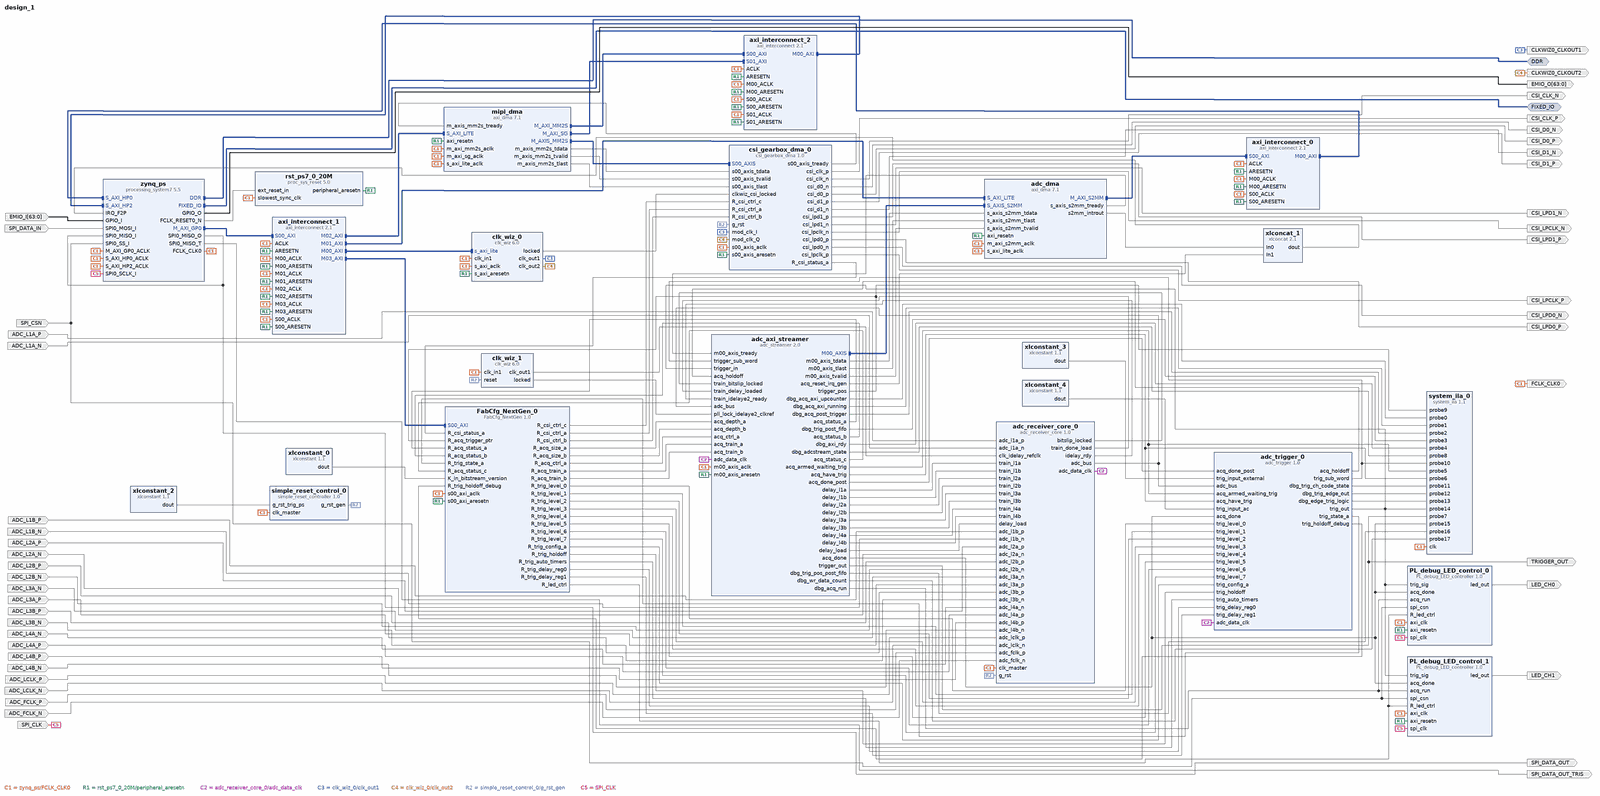
[diagram p0: block diagram of the top level, whole]
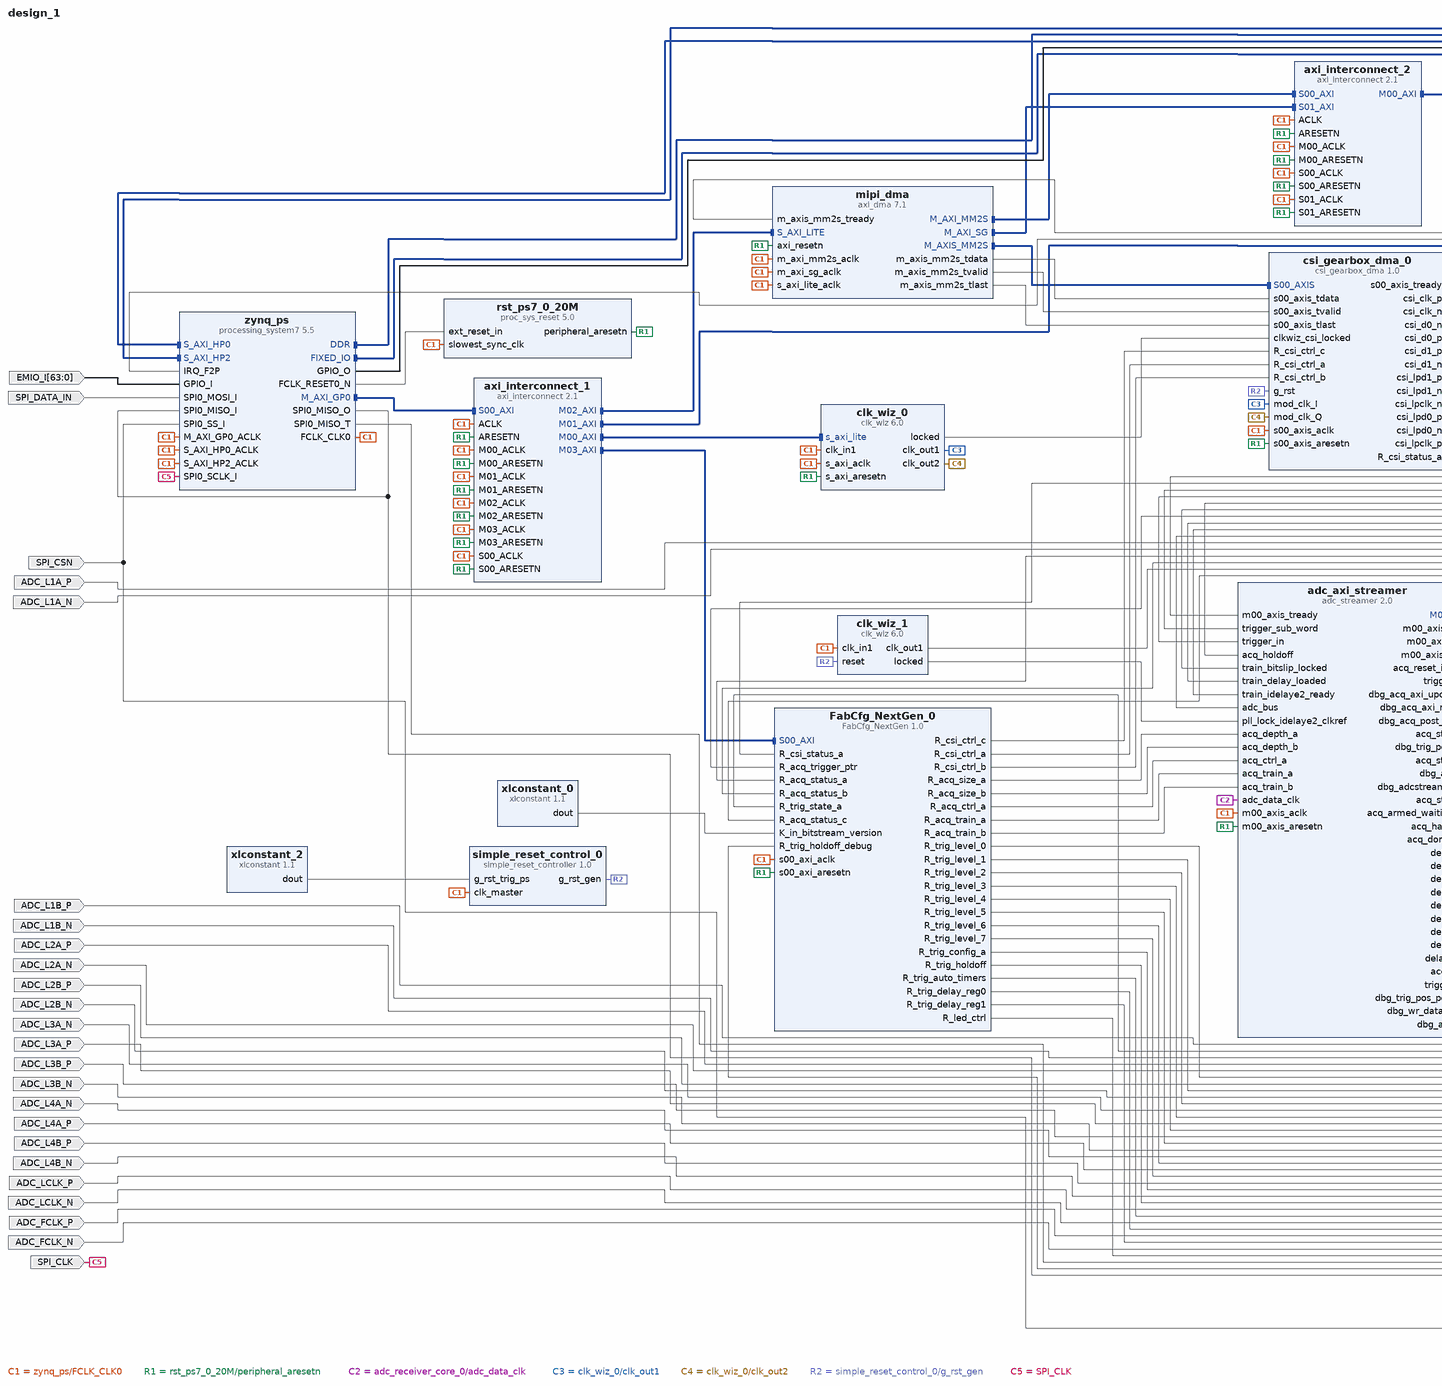
[diagram p1: block diagram of the top level, left part]
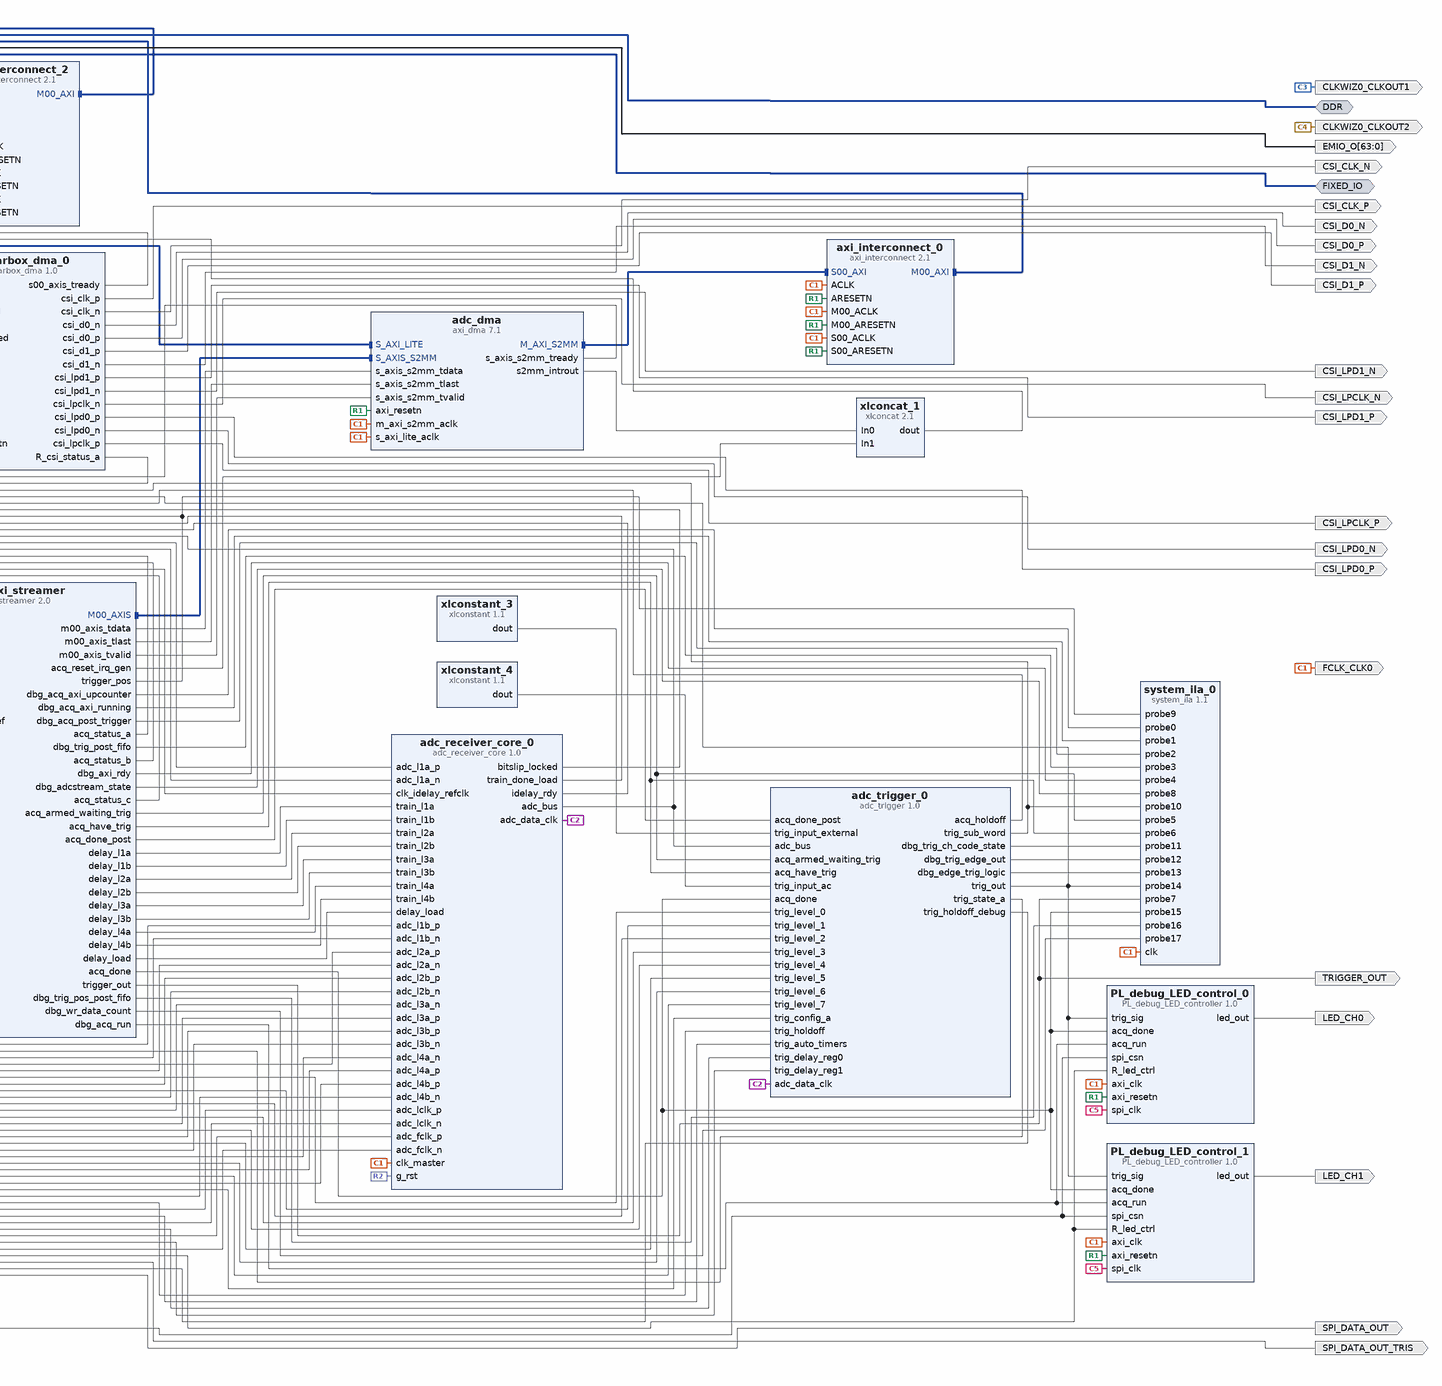
[diagram p2: block diagram of the top level, right part]
# Vivado block design design_1, xc7z014sclg400-1, Vivado 2019.2
create_bd_design design_1

create_bd_intf_port -mode Master -vlnv xilinx.com:interface:ddrx_rtl:1.0 DDR
create_bd_intf_port -mode Master -vlnv xilinx.com:display_processing_system7:fixedio_rtl:1.0 FIXED_IO
create_bd_port -dir O -type clk FCLK_CLK0
create_bd_port -dir I -from 63 -to 0 EMIO_I
create_bd_port -dir O -from 63 -to 0 EMIO_O
create_bd_port -dir O TRIGGER_OUT
create_bd_port -dir O -type clk CLKWIZ0_CLKOUT1
create_bd_port -dir O -type clk CLKWIZ0_CLKOUT2
create_bd_port -dir O CSI_CLK_P
create_bd_port -dir O CSI_CLK_N
create_bd_port -dir O CSI_D0_P
create_bd_port -dir O CSI_D0_N
create_bd_port -dir O CSI_D1_P
create_bd_port -dir O CSI_D1_N
create_bd_port -dir O CSI_LPD0_P
create_bd_port -dir O CSI_LPD0_N
create_bd_port -dir O CSI_LPD1_P
create_bd_port -dir O CSI_LPD1_N
create_bd_port -dir O CSI_LPCLK_P
create_bd_port -dir O CSI_LPCLK_N
create_bd_port -dir I ADC_L1A_P
create_bd_port -dir I ADC_L1A_N
create_bd_port -dir I ADC_L1B_P
create_bd_port -dir I ADC_L1B_N
create_bd_port -dir I ADC_L2A_P
create_bd_port -dir I ADC_L2B_P
create_bd_port -dir I ADC_L2A_N
create_bd_port -dir I ADC_L2B_N
create_bd_port -dir I ADC_L3A_P
create_bd_port -dir I ADC_L3A_N
create_bd_port -dir I ADC_L3B_P
create_bd_port -dir I ADC_L3B_N
create_bd_port -dir I ADC_L4A_P
create_bd_port -dir I ADC_L4B_P
create_bd_port -dir I ADC_L4A_N
create_bd_port -dir I ADC_L4B_N
create_bd_port -dir I ADC_LCLK_P
create_bd_port -dir I ADC_LCLK_N
create_bd_port -dir I ADC_FCLK_P
create_bd_port -dir I ADC_FCLK_N
create_bd_port -dir I SPI_CLK
create_bd_port -dir I SPI_DATA_IN
create_bd_port -dir O SPI_DATA_OUT
create_bd_port -dir O SPI_DATA_OUT_TRIS
create_bd_port -dir I SPI_CSN
create_bd_port -dir O LED_CH0
create_bd_port -dir O LED_CH1

create_bd_cell -type ip -vlnv xilinx.com:ip:proc_sys_reset:5.0 rst_ps7_0_20M
create_bd_cell -type ip -vlnv xilinx.com:ip:processing_system7:5.5 zynq_ps
set_property -dict [list \
  CONFIG.PCW_FPGA0_PERIPHERAL_FREQMHZ 177 \
  CONFIG.PCW_FPGA1_PERIPHERAL_FREQMHZ 150 \
  CONFIG.PCW_GPIO_EMIO_GPIO_ENABLE 1 \
  CONFIG.PCW_GPIO_EMIO_GPIO_IO 64 \
  CONFIG.PCW_GPIO_MIO_GPIO_ENABLE 1 \
  CONFIG.PCW_GPIO_MIO_GPIO_IO MIO \
  CONFIG.PCW_I2C_RESET_ENABLE 0 \
  CONFIG.PCW_IRQ_F2P_INTR 1 \
  CONFIG.PCW_SD0_GRP_CD_ENABLE 1 \
  CONFIG.PCW_SD0_GRP_CD_IO {MIO 46} \
  CONFIG.PCW_SD0_GRP_WP_ENABLE 1 \
  CONFIG.PCW_SD0_GRP_WP_IO {MIO 47} \
  CONFIG.PCW_SD0_PERIPHERAL_ENABLE 1 \
  CONFIG.PCW_SD0_SD0_IO {MIO 40 .. 45} \
  CONFIG.PCW_SDIO_PERIPHERAL_FREQMHZ 100 \
  CONFIG.PCW_SPI0_PERIPHERAL_ENABLE 1 \
  CONFIG.PCW_SPI0_SPI0_IO EMIO \
  CONFIG.PCW_TTC0_PERIPHERAL_ENABLE 1 \
  CONFIG.PCW_TTC0_TTC0_IO EMIO \
  CONFIG.PCW_TTC1_PERIPHERAL_ENABLE 1 \
  CONFIG.PCW_TTC1_TTC1_IO EMIO \
  CONFIG.PCW_UART1_BAUD_RATE 460800 \
  CONFIG.PCW_UART1_PERIPHERAL_ENABLE 1 \
  CONFIG.PCW_UART1_UART1_IO {MIO 48 .. 49} \
  CONFIG.PCW_UART_PERIPHERAL_FREQMHZ 100 \
  CONFIG.PCW_UIPARAM_DDR_BUS_WIDTH {16 Bit} \
  CONFIG.PCW_UIPARAM_DDR_PARTNO {MT41K128M16 JT-125} \
  CONFIG.PCW_USB_RESET_ENABLE 0 \
  CONFIG.PCW_USE_FABRIC_INTERRUPT 1 \
  CONFIG.PCW_USE_S_AXI_HP0 1 \
  CONFIG.PCW_USE_S_AXI_HP2 1 \
] [get_bd_cells zynq_ps]
# 243 more settings of zynq_ps are not shown: defaults, MIO pin electricals, DDR timing, and values the tool derives
create_bd_cell -type ip -vlnv xilinx.com:ip:axi_dma:7.1 adc_dma
set_property -dict [list \
  CONFIG.c_include_mm2s 0 \
  CONFIG.c_include_s2mm 1 \
  CONFIG.c_include_s2mm_dre 1 \
  CONFIG.c_include_sg 0 \
  CONFIG.c_m_axi_s2mm_data_width 64 \
  CONFIG.c_s2mm_burst_size 16 \
  CONFIG.c_sg_length_width 24 \
] [get_bd_cells adc_dma]
create_bd_cell -type ip -vlnv xilinx.com:ip:xlconcat:2.1 xlconcat_1
set_property -dict [list \
  CONFIG.IN0_WIDTH 1 \
  CONFIG.IN1_WIDTH 1 \
  CONFIG.IN2_WIDTH 1 \
  CONFIG.IN3_WIDTH 4 \
  CONFIG.NUM_PORTS 2 \
  CONFIG.dout_width 2 \
] [get_bd_cells xlconcat_1]
create_bd_cell -type ip -vlnv xilinx.com:ip:clk_wiz:6.0 clk_wiz_0
set_property -dict [list \
  CONFIG.CLKIN1_JITTER_PS 56.239999999999995 \
  CONFIG.CLKOUT1_JITTER 87.564 \
  CONFIG.CLKOUT1_PHASE_ERROR 97.786 \
  CONFIG.CLKOUT1_REQUESTED_OUT_FREQ 400.000 \
  CONFIG.CLKOUT2_JITTER 87.564 \
  CONFIG.CLKOUT2_PHASE_ERROR 97.786 \
  CONFIG.CLKOUT2_REQUESTED_OUT_FREQ 400.000 \
  CONFIG.CLKOUT2_REQUESTED_PHASE 90 \
  CONFIG.CLKOUT2_USED true \
  CONFIG.MMCM_CLKFBOUT_MULT_F 4.500 \
  CONFIG.MMCM_CLKIN1_PERIOD 5.625 \
  CONFIG.MMCM_CLKIN2_PERIOD 10.0 \
  CONFIG.MMCM_CLKOUT0_DIVIDE_F 2.000 \
  CONFIG.MMCM_CLKOUT1_DIVIDE 2 \
  CONFIG.MMCM_CLKOUT1_PHASE 90.000 \
  CONFIG.MMCM_DIVCLK_DIVIDE 1 \
  CONFIG.NUM_OUT_CLKS 2 \
  CONFIG.USE_DYN_RECONFIG true \
] [get_bd_cells clk_wiz_0]
create_bd_cell -type ip -vlnv xilinx.com:ip:axi_interconnect:2.1 axi_interconnect_1
set_property -dict [list \
  CONFIG.ENABLE_ADVANCED_OPTIONS 1 \
  CONFIG.ENABLE_PROTOCOL_CHECKERS 0 \
  CONFIG.NUM_MI 4 \
  CONFIG.NUM_SI 1 \
  CONFIG.S00_HAS_DATA_FIFO 2 \
  CONFIG.STRATEGY 2 \
  CONFIG.SYNCHRONIZATION_STAGES 2 \
] [get_bd_cells axi_interconnect_1]
create_bd_cell -type ip -vlnv xilinx.com:ip:axi_dma:7.1 mipi_dma
set_property -dict [list \
  CONFIG.c_include_mm2s 1 \
  CONFIG.c_include_mm2s_dre 0 \
  CONFIG.c_include_s2mm 0 \
  CONFIG.c_include_sg 1 \
  CONFIG.c_m_axi_mm2s_data_width 64 \
  CONFIG.c_m_axis_mm2s_tdata_width 64 \
  CONFIG.c_mm2s_burst_size 32 \
  CONFIG.c_sg_length_width 24 \
] [get_bd_cells mipi_dma]
create_bd_cell -type ip -vlnv xilinx.com:ip:axi_interconnect:2.1 axi_interconnect_2
set_property -dict {CONFIG.NUM_MI 1 CONFIG.NUM_SI 2} [get_bd_cells axi_interconnect_2]
create_bd_cell -type ip -vlnv xilinx.com:ip:xlconstant:1.1 xlconstant_0
set_property -dict {CONFIG.CONST_VAL 0xb37a0001 CONFIG.CONST_WIDTH 32} [get_bd_cells xlconstant_0]
create_bd_cell -type ip -vlnv xilinx.com:user:simple_reset_controller:1.0 simple_reset_control_0
create_bd_cell -type ip -vlnv xilinx.com:ip:xlconstant:1.1 xlconstant_2
set_property -dict {CONFIG.CONST_VAL 0 CONFIG.CONST_WIDTH 1} [get_bd_cells xlconstant_2]
create_bd_cell -type ip -vlnv xilinx.com:ip:clk_wiz:6.0 clk_wiz_1
set_property -dict [list \
  CONFIG.CLKIN1_JITTER_PS 56.239999999999995 \
  CONFIG.CLKOUT1_JITTER 100.156 \
  CONFIG.CLKOUT1_PHASE_ERROR 97.786 \
  CONFIG.CLKOUT1_REQUESTED_OUT_FREQ 200.000 \
  CONFIG.MMCM_CLKFBOUT_MULT_F 4.500 \
  CONFIG.MMCM_CLKIN1_PERIOD 5.625 \
  CONFIG.MMCM_CLKIN2_PERIOD 10.0 \
  CONFIG.MMCM_CLKOUT0_DIVIDE_F 4.000 \
] [get_bd_cells clk_wiz_1]
create_bd_cell -type ip -vlnv xilinx.com:ip:axi_interconnect:2.1 axi_interconnect_0
set_property -dict {CONFIG.NUM_MI 1 CONFIG.NUM_SI 1} [get_bd_cells axi_interconnect_0]
create_bd_cell -type ip -vlnv xilinx.com:ip:xlconstant:1.1 xlconstant_3
set_property -dict {CONFIG.CONST_VAL 0 CONFIG.CONST_WIDTH 1} [get_bd_cells xlconstant_3]
create_bd_cell -type ip -vlnv xilinx.com:ip:xlconstant:1.1 xlconstant_4
set_property -dict {CONFIG.CONST_VAL 0 CONFIG.CONST_WIDTH 1} [get_bd_cells xlconstant_4]
create_bd_cell -type ip -vlnv xilinx.com:user:adc_receiver_core:1.0 adc_receiver_core_0
create_bd_cell -type ip -vlnv xilinx.com:user:FabCfg_NextGen:1.0 FabCfg_NextGen_0
create_bd_cell -type ip -vlnv xilinx.com:user:PL_debug_LED_controller:1.0 PL_debug_LED_control_0
create_bd_cell -type ip -vlnv xilinx.com:user:PL_debug_LED_controller:1.0 PL_debug_LED_control_1
set_property -dict {CONFIG.LED_BYTE_CHANNEL 1} [get_bd_cells PL_debug_LED_control_1]
create_bd_cell -type ip -vlnv xilinx.com:user:csi_gearbox_dma:1.0 csi_gearbox_dma_0
set_property -dict {CONFIG.C_PN_SWAP_CLK true CONFIG.C_PN_SWAP_D0 true CONFIG.C_PN_SWAP_D1 true} [get_bd_cells csi_gearbox_dma_0]
create_bd_cell -type ip -vlnv xilinx.com:user:adc_trigger:1.0 adc_trigger_0
set_property -dict [list \
  CONFIG.TRIG_STATE_TRIGD_AUTO_INITIAL 5 \
  CONFIG.TRIG_STATE_TRIGD_AUTO_REPEAT 6 \
  CONFIG.TRIG_STATE_TRIGD_FORCE_AUTO 7 \
] [get_bd_cells adc_trigger_0]
create_bd_cell -type ip -vlnv xilinx.com:ip:system_ila:1.1 system_ila_0
set_property -dict {CONFIG.C_DATA_DEPTH 16384 CONFIG.C_MON_TYPE NATIVE CONFIG.C_NUM_OF_PROBES 18} [get_bd_cells system_ila_0]
create_bd_cell -type ip -vlnv xilinx.com:user:adc_streamer:2.0 adc_axi_streamer

# ---- connections ----

connect_bd_intf_net [get_bd_intf_pins axi_interconnect_1/M01_AXI] [get_bd_intf_pins adc_dma/S_AXI_LITE]
connect_bd_intf_net [get_bd_intf_pins mipi_dma/S_AXI_LITE] [get_bd_intf_pins axi_interconnect_1/M02_AXI]
connect_bd_intf_net [get_bd_intf_pins axi_interconnect_0/S00_AXI] [get_bd_intf_pins adc_dma/M_AXI_S2MM]
connect_bd_intf_net [get_bd_intf_pins axi_interconnect_2/S00_AXI] [get_bd_intf_pins mipi_dma/M_AXI_MM2S]
connect_bd_intf_net -intf_net processing_system7_0_DDR [get_bd_intf_ports DDR] [get_bd_intf_pins zynq_ps/DDR]
connect_bd_intf_net -intf_net axi_dma1_M_AXIS_MM2S [get_bd_intf_pins csi_gearbox_dma_0/S00_AXIS] [get_bd_intf_pins mipi_dma/M_AXIS_MM2S]
connect_bd_intf_net [get_bd_intf_pins axi_interconnect_1/M03_AXI] [get_bd_intf_pins FabCfg_NextGen_0/S00_AXI]
connect_bd_intf_net [get_bd_intf_pins axi_interconnect_1/M00_AXI] [get_bd_intf_pins clk_wiz_0/s_axi_lite]
connect_bd_intf_net [get_bd_intf_pins adc_axi_streamer/M00_AXIS] [get_bd_intf_pins adc_dma/S_AXIS_S2MM]
connect_bd_intf_net [get_bd_intf_pins axi_interconnect_0/M00_AXI] [get_bd_intf_pins zynq_ps/S_AXI_HP0]
connect_bd_intf_net [get_bd_intf_pins axi_interconnect_2/M00_AXI] [get_bd_intf_pins zynq_ps/S_AXI_HP2]
connect_bd_intf_net [get_bd_intf_pins zynq_ps/M_AXI_GP0] [get_bd_intf_pins axi_interconnect_1/S00_AXI]
connect_bd_intf_net [get_bd_intf_pins mipi_dma/M_AXI_SG] [get_bd_intf_pins axi_interconnect_2/S01_AXI]
connect_bd_intf_net -intf_net processing_system7_0_FIXED_IO [get_bd_intf_ports FIXED_IO] [get_bd_intf_pins zynq_ps/FIXED_IO]
connect_bd_net -net processing_system7_0_FCLK_CLK0 [get_bd_pins zynq_ps/FCLK_CLK0] \
  [get_bd_ports FCLK_CLK0] [get_bd_pins rst_ps7_0_20M/slowest_sync_clk] [get_bd_pins zynq_ps/S_AXI_HP0_ACLK] \
  [get_bd_pins adc_dma/s_axi_lite_aclk] [get_bd_pins adc_dma/m_axi_s2mm_aclk] [get_bd_pins zynq_ps/M_AXI_GP0_ACLK] \
  [get_bd_pins clk_wiz_0/s_axi_aclk] [get_bd_pins clk_wiz_0/clk_in1] [get_bd_pins axi_interconnect_1/M01_ACLK] \
  [get_bd_pins axi_interconnect_1/M00_ACLK] [get_bd_pins axi_interconnect_1/S00_ACLK] [get_bd_pins mipi_dma/m_axi_mm2s_aclk] \
  [get_bd_pins axi_interconnect_2/S00_ACLK] [get_bd_pins mipi_dma/s_axi_lite_aclk] [get_bd_pins axi_interconnect_2/M00_ACLK] \
  [get_bd_pins simple_reset_control_0/clk_master] [get_bd_pins clk_wiz_1/clk_in1] [get_bd_pins axi_interconnect_1/ACLK] \
  [get_bd_pins axi_interconnect_2/ACLK] [get_bd_pins axi_interconnect_0/ACLK] [get_bd_pins axi_interconnect_0/M00_ACLK] \
  [get_bd_pins axi_interconnect_0/S00_ACLK] [get_bd_pins axi_interconnect_1/M02_ACLK] \
  [get_bd_pins adc_receiver_core_0/clk_master] [get_bd_pins axi_interconnect_1/M03_ACLK] [get_bd_pins zynq_ps/S_AXI_HP2_ACLK] \
  [get_bd_pins mipi_dma/m_axi_sg_aclk] [get_bd_pins FabCfg_NextGen_0/s00_axi_aclk] \
  [get_bd_pins PL_debug_LED_control_0/axi_clk] [get_bd_pins PL_debug_LED_control_1/axi_clk] \
  [get_bd_pins axi_interconnect_2/S01_ACLK] [get_bd_pins csi_gearbox_dma_0/s00_axis_aclk] [get_bd_pins system_ila_0/clk] \
  [get_bd_pins adc_axi_streamer/m00_axis_aclk]
connect_bd_net [get_bd_pins rst_ps7_0_20M/peripheral_aresetn] \
  [get_bd_pins adc_dma/axi_resetn] [get_bd_pins clk_wiz_0/s_axi_aresetn] [get_bd_pins axi_interconnect_1/M00_ARESETN] \
  [get_bd_pins axi_interconnect_1/M01_ARESETN] [get_bd_pins axi_interconnect_1/S00_ARESETN] \
  [get_bd_pins axi_interconnect_1/ARESETN] [get_bd_pins axi_interconnect_2/S00_ARESETN] [get_bd_pins mipi_dma/axi_resetn] \
  [get_bd_pins axi_interconnect_2/ARESETN] [get_bd_pins axi_interconnect_2/M00_ARESETN] \
  [get_bd_pins axi_interconnect_0/ARESETN] [get_bd_pins axi_interconnect_0/M00_ARESETN] \
  [get_bd_pins axi_interconnect_0/S00_ARESETN] [get_bd_pins axi_interconnect_1/M02_ARESETN] \
  [get_bd_pins axi_interconnect_1/M03_ARESETN] [get_bd_pins FabCfg_NextGen_0/s00_axi_aresetn] \
  [get_bd_pins PL_debug_LED_control_0/axi_resetn] [get_bd_pins PL_debug_LED_control_1/axi_resetn] \
  [get_bd_pins axi_interconnect_2/S01_ARESETN] [get_bd_pins csi_gearbox_dma_0/s00_axis_aresetn] \
  [get_bd_pins adc_axi_streamer/m00_axis_aresetn]
connect_bd_net -net processing_system7_0_FCLK_RESET0_N [get_bd_pins zynq_ps/FCLK_RESET0_N] [get_bd_pins rst_ps7_0_20M/ext_reset_in]
connect_bd_net [get_bd_ports EMIO_I] [get_bd_pins zynq_ps/GPIO_I]
connect_bd_net -net processing_system7_0_GPIO_O [get_bd_pins zynq_ps/GPIO_O] [get_bd_ports EMIO_O]
connect_bd_net [get_bd_pins xlconcat_1/dout] [get_bd_pins zynq_ps/IRQ_F2P]
connect_bd_net -net axi_dma_s2mm_introut [get_bd_pins adc_dma/s2mm_introut] [get_bd_pins xlconcat_1/In0]
connect_bd_net -net ADC_DATA_CLK_2 [get_bd_pins adc_receiver_core_0/adc_data_clk] \
  [get_bd_pins adc_trigger_0/adc_data_clk] [get_bd_pins adc_axi_streamer/adc_data_clk]
connect_bd_net -net ACQ_TRIGGER_IN_1 [get_bd_pins adc_trigger_0/trig_out] \
  [get_bd_pins PL_debug_LED_control_0/trig_sig] [get_bd_pins PL_debug_LED_control_1/trig_sig] \
  [get_bd_pins system_ila_0/probe14] [get_bd_pins adc_axi_streamer/trigger_in]
connect_bd_net -net ACQ_TRIG_WORD_1 [get_bd_pins adc_trigger_0/trig_sub_word] \
  [get_bd_pins system_ila_0/probe10] [get_bd_pins adc_axi_streamer/trigger_sub_word]
connect_bd_net [get_bd_pins adc_axi_streamer/trigger_out] [get_bd_ports TRIGGER_OUT] [get_bd_pins system_ila_0/probe7]
connect_bd_net -net axi_dma_s_axis_s2mm_tready [get_bd_pins adc_dma/s_axis_s2mm_tready] [get_bd_pins adc_axi_streamer/m00_axis_tready]
connect_bd_net [get_bd_pins adc_axi_streamer/m00_axis_tdata] [get_bd_pins adc_dma/s_axis_s2mm_tdata]
connect_bd_net [get_bd_pins adc_axi_streamer/m00_axis_tlast] [get_bd_pins adc_dma/s_axis_s2mm_tlast]
connect_bd_net [get_bd_pins adc_axi_streamer/m00_axis_tvalid] [get_bd_pins adc_dma/s_axis_s2mm_tvalid]
connect_bd_net [get_bd_pins clk_wiz_0/clk_out1] [get_bd_ports CLKWIZ0_CLKOUT1] [get_bd_pins csi_gearbox_dma_0/mod_clk_I]
connect_bd_net [get_bd_pins clk_wiz_0/clk_out2] [get_bd_ports CLKWIZ0_CLKOUT2] [get_bd_pins csi_gearbox_dma_0/mod_clk_Q]
connect_bd_net [get_bd_pins mipi_dma/m_axis_mm2s_tdata] [get_bd_pins csi_gearbox_dma_0/s00_axis_tdata]
connect_bd_net [get_bd_pins mipi_dma/m_axis_mm2s_tvalid] [get_bd_pins csi_gearbox_dma_0/s00_axis_tvalid]
connect_bd_net [get_bd_pins csi_gearbox_dma_0/s00_axis_tready] [get_bd_pins mipi_dma/m_axis_mm2s_tready]
connect_bd_net [get_bd_pins mipi_dma/m_axis_mm2s_tlast] [get_bd_pins csi_gearbox_dma_0/s00_axis_tlast]
connect_bd_net [get_bd_pins adc_axi_streamer/trigger_pos] [get_bd_pins FabCfg_NextGen_0/R_acq_trigger_ptr] [get_bd_pins system_ila_0/probe9]
connect_bd_net [get_bd_pins FabCfg_NextGen_0/R_acq_size_a] [get_bd_pins adc_axi_streamer/acq_depth_a]
connect_bd_net [get_bd_pins FabCfg_NextGen_0/R_acq_size_b] [get_bd_pins adc_axi_streamer/acq_depth_b]
connect_bd_net [get_bd_pins xlconstant_0/dout] [get_bd_pins FabCfg_NextGen_0/K_in_bitstream_version]
connect_bd_net [get_bd_pins csi_gearbox_dma_0/csi_clk_p] [get_bd_ports CSI_CLK_P]
connect_bd_net [get_bd_pins csi_gearbox_dma_0/csi_clk_n] [get_bd_ports CSI_CLK_N]
connect_bd_net [get_bd_pins csi_gearbox_dma_0/csi_d0_n] [get_bd_ports CSI_D0_N]
connect_bd_net [get_bd_pins csi_gearbox_dma_0/csi_d0_p] [get_bd_ports CSI_D0_P]
connect_bd_net [get_bd_pins csi_gearbox_dma_0/csi_d1_p] [get_bd_ports CSI_D1_P]
connect_bd_net [get_bd_pins csi_gearbox_dma_0/csi_d1_n] [get_bd_ports CSI_D1_N]
connect_bd_net [get_bd_pins csi_gearbox_dma_0/csi_lpd1_p] [get_bd_ports CSI_LPD1_P]
connect_bd_net [get_bd_pins csi_gearbox_dma_0/csi_lpd1_n] [get_bd_ports CSI_LPD1_N]
connect_bd_net [get_bd_pins csi_gearbox_dma_0/csi_lpclk_n] [get_bd_ports CSI_LPCLK_N]
connect_bd_net [get_bd_pins simple_reset_control_0/g_rst_gen] \
  [get_bd_pins clk_wiz_1/reset] [get_bd_pins adc_receiver_core_0/g_rst] [get_bd_pins csi_gearbox_dma_0/g_rst]
connect_bd_net [get_bd_pins xlconstant_2/dout] [get_bd_pins simple_reset_control_0/g_rst_trig_ps]
connect_bd_net [get_bd_ports ADC_L1A_P] [get_bd_pins adc_receiver_core_0/adc_l1a_p]
connect_bd_net [get_bd_ports ADC_L1A_N] [get_bd_pins adc_receiver_core_0/adc_l1a_n]
connect_bd_net [get_bd_ports ADC_L1B_P] [get_bd_pins adc_receiver_core_0/adc_l1b_p]
connect_bd_net [get_bd_ports ADC_L1B_N] [get_bd_pins adc_receiver_core_0/adc_l1b_n]
connect_bd_net [get_bd_ports ADC_L2A_P] [get_bd_pins adc_receiver_core_0/adc_l2a_p]
connect_bd_net [get_bd_ports ADC_L2A_N] [get_bd_pins adc_receiver_core_0/adc_l2a_n]
connect_bd_net [get_bd_ports ADC_L2B_P] [get_bd_pins adc_receiver_core_0/adc_l2b_p]
connect_bd_net [get_bd_ports ADC_L2B_N] [get_bd_pins adc_receiver_core_0/adc_l2b_n]
connect_bd_net [get_bd_ports ADC_L3A_N] [get_bd_pins adc_receiver_core_0/adc_l3a_n]
connect_bd_net [get_bd_ports ADC_L3A_P] [get_bd_pins adc_receiver_core_0/adc_l3a_p]
connect_bd_net [get_bd_ports ADC_L3B_P] [get_bd_pins adc_receiver_core_0/adc_l3b_p]
connect_bd_net [get_bd_ports ADC_L3B_N] [get_bd_pins adc_receiver_core_0/adc_l3b_n]
connect_bd_net [get_bd_ports ADC_L4A_N] [get_bd_pins adc_receiver_core_0/adc_l4a_n]
connect_bd_net [get_bd_ports ADC_L4A_P] [get_bd_pins adc_receiver_core_0/adc_l4a_p]
connect_bd_net [get_bd_ports ADC_L4B_P] [get_bd_pins adc_receiver_core_0/adc_l4b_p]
connect_bd_net [get_bd_ports ADC_L4B_N] [get_bd_pins adc_receiver_core_0/adc_l4b_n]
connect_bd_net [get_bd_ports ADC_LCLK_P] [get_bd_pins adc_receiver_core_0/adc_lclk_p]
connect_bd_net [get_bd_ports ADC_LCLK_N] [get_bd_pins adc_receiver_core_0/adc_lclk_n]
connect_bd_net [get_bd_ports ADC_FCLK_P] [get_bd_pins adc_receiver_core_0/adc_fclk_p]
connect_bd_net [get_bd_ports ADC_FCLK_N] [get_bd_pins adc_receiver_core_0/adc_fclk_n]
connect_bd_net [get_bd_pins clk_wiz_1/clk_out1] [get_bd_pins adc_receiver_core_0/clk_idelay_refclk]
connect_bd_net [get_bd_pins adc_axi_streamer/acq_status_a] [get_bd_pins FabCfg_NextGen_0/R_acq_status_a]
connect_bd_net [get_bd_pins adc_axi_streamer/acq_status_b] [get_bd_pins FabCfg_NextGen_0/R_acq_status_b]
connect_bd_net [get_bd_pins FabCfg_NextGen_0/R_acq_ctrl_a] [get_bd_pins adc_axi_streamer/acq_ctrl_a]
connect_bd_net [get_bd_pins adc_axi_streamer/acq_reset_irq_gen] [get_bd_pins xlconcat_1/In1]
connect_bd_net [get_bd_pins clk_wiz_1/locked] [get_bd_pins adc_axi_streamer/pll_lock_idelaye2_clkref]
connect_bd_net [get_bd_pins FabCfg_NextGen_0/R_trig_level_0] [get_bd_pins adc_trigger_0/trig_level_0]
connect_bd_net [get_bd_pins FabCfg_NextGen_0/R_trig_level_1] [get_bd_pins adc_trigger_0/trig_level_1]
connect_bd_net [get_bd_pins FabCfg_NextGen_0/R_trig_level_2] [get_bd_pins adc_trigger_0/trig_level_2]
connect_bd_net [get_bd_pins FabCfg_NextGen_0/R_trig_level_3] [get_bd_pins adc_trigger_0/trig_level_3]
connect_bd_net [get_bd_pins FabCfg_NextGen_0/R_trig_level_4] [get_bd_pins adc_trigger_0/trig_level_4]
connect_bd_net [get_bd_pins FabCfg_NextGen_0/R_trig_level_5] [get_bd_pins adc_trigger_0/trig_level_5]
connect_bd_net [get_bd_pins FabCfg_NextGen_0/R_trig_level_6] [get_bd_pins adc_trigger_0/trig_level_6]
connect_bd_net [get_bd_pins FabCfg_NextGen_0/R_trig_level_7] [get_bd_pins adc_trigger_0/trig_level_7]
connect_bd_net [get_bd_pins FabCfg_NextGen_0/R_trig_config_a] [get_bd_pins adc_trigger_0/trig_config_a]
connect_bd_net -net ADC_BUS_1 [get_bd_pins adc_receiver_core_0/adc_bus] [get_bd_pins adc_trigger_0/adc_bus] [get_bd_pins adc_axi_streamer/adc_bus]
connect_bd_net [get_bd_pins xlconstant_3/dout] [get_bd_pins adc_trigger_0/trig_input_external]
connect_bd_net [get_bd_pins xlconstant_4/dout] [get_bd_pins adc_trigger_0/trig_input_ac]
connect_bd_net [get_bd_pins adc_axi_streamer/delay_l1a] [get_bd_pins adc_receiver_core_0/train_l1a]
connect_bd_net [get_bd_pins adc_axi_streamer/delay_l1b] [get_bd_pins adc_receiver_core_0/train_l1b]
connect_bd_net [get_bd_pins adc_axi_streamer/delay_l2a] [get_bd_pins adc_receiver_core_0/train_l2a]
connect_bd_net [get_bd_pins adc_axi_streamer/delay_l2b] [get_bd_pins adc_receiver_core_0/train_l2b]
connect_bd_net [get_bd_pins adc_axi_streamer/delay_l3a] [get_bd_pins adc_receiver_core_0/train_l3a]
connect_bd_net [get_bd_pins adc_axi_streamer/delay_l3b] [get_bd_pins adc_receiver_core_0/train_l3b]
connect_bd_net [get_bd_pins adc_axi_streamer/delay_l4a] [get_bd_pins adc_receiver_core_0/train_l4a]
connect_bd_net [get_bd_pins adc_axi_streamer/delay_l4b] [get_bd_pins adc_receiver_core_0/train_l4b]
connect_bd_net [get_bd_pins adc_axi_streamer/delay_load] [get_bd_pins adc_receiver_core_0/delay_load]
connect_bd_net [get_bd_pins adc_receiver_core_0/bitslip_locked] [get_bd_pins adc_axi_streamer/train_bitslip_locked]
connect_bd_net [get_bd_pins adc_receiver_core_0/train_done_load] [get_bd_pins adc_axi_streamer/train_delay_loaded]
connect_bd_net [get_bd_pins adc_receiver_core_0/idelay_rdy] [get_bd_pins adc_axi_streamer/train_idelaye2_ready]
connect_bd_net [get_bd_pins FabCfg_NextGen_0/R_acq_train_a] [get_bd_pins adc_axi_streamer/acq_train_a]
connect_bd_net [get_bd_pins FabCfg_NextGen_0/R_acq_train_b] [get_bd_pins adc_axi_streamer/acq_train_b]
connect_bd_net [get_bd_pins adc_axi_streamer/acq_status_c] [get_bd_pins FabCfg_NextGen_0/R_acq_status_c]
connect_bd_net [get_bd_pins FabCfg_NextGen_0/R_trig_holdoff] [get_bd_pins adc_trigger_0/trig_holdoff]
connect_bd_net [get_bd_pins FabCfg_NextGen_0/R_trig_auto_timers] [get_bd_pins adc_trigger_0/trig_auto_timers]
connect_bd_net [get_bd_pins FabCfg_NextGen_0/R_trig_delay_reg0] [get_bd_pins adc_trigger_0/trig_delay_reg0]
connect_bd_net [get_bd_pins FabCfg_NextGen_0/R_trig_delay_reg1] [get_bd_pins adc_trigger_0/trig_delay_reg1]
connect_bd_net [get_bd_pins adc_trigger_0/trig_state_a] [get_bd_pins FabCfg_NextGen_0/R_trig_state_a]
connect_bd_net [get_bd_pins adc_trigger_0/acq_holdoff] [get_bd_pins adc_axi_streamer/acq_holdoff]
connect_bd_net [get_bd_pins adc_trigger_0/trig_holdoff_debug] [get_bd_pins FabCfg_NextGen_0/R_trig_holdoff_debug]
connect_bd_net [get_bd_pins adc_axi_streamer/acq_armed_waiting_trig] \
  [get_bd_pins adc_trigger_0/acq_armed_waiting_trig] [get_bd_pins system_ila_0/probe5]
connect_bd_net [get_bd_pins adc_axi_streamer/acq_done] \
  [get_bd_pins PL_debug_LED_control_0/acq_done] [get_bd_pins PL_debug_LED_control_1/acq_done] \
  [get_bd_pins adc_trigger_0/acq_done] [get_bd_pins system_ila_0/probe15]
connect_bd_net [get_bd_pins adc_axi_streamer/acq_done_post] [get_bd_pins adc_trigger_0/acq_done_post]
connect_bd_net [get_bd_pins adc_axi_streamer/acq_have_trig] [get_bd_pins adc_trigger_0/acq_have_trig] [get_bd_pins system_ila_0/probe6]
connect_bd_net [get_bd_ports SPI_CLK] \
  [get_bd_pins zynq_ps/SPI0_SCLK_I] [get_bd_pins PL_debug_LED_control_0/spi_clk] [get_bd_pins PL_debug_LED_control_1/spi_clk]
connect_bd_net [get_bd_ports SPI_DATA_IN] [get_bd_pins zynq_ps/SPI0_MOSI_I]
connect_bd_net [get_bd_pins zynq_ps/SPI0_MISO_O] [get_bd_ports SPI_DATA_OUT] [get_bd_pins zynq_ps/SPI0_MISO_I]
connect_bd_net [get_bd_pins zynq_ps/SPI0_MISO_T] [get_bd_ports SPI_DATA_OUT_TRIS]
connect_bd_net [get_bd_ports SPI_CSN] \
  [get_bd_pins zynq_ps/SPI0_SS_I] [get_bd_pins PL_debug_LED_control_0/spi_csn] [get_bd_pins PL_debug_LED_control_1/spi_csn]
connect_bd_net [get_bd_pins FabCfg_NextGen_0/R_csi_ctrl_c] [get_bd_pins csi_gearbox_dma_0/R_csi_ctrl_c]
connect_bd_net [get_bd_pins clk_wiz_0/locked] [get_bd_pins csi_gearbox_dma_0/clkwiz_csi_locked]
connect_bd_net [get_bd_pins csi_gearbox_dma_0/csi_lpd0_p] [get_bd_ports CSI_LPD0_P]
connect_bd_net [get_bd_pins csi_gearbox_dma_0/csi_lpd0_n] [get_bd_ports CSI_LPD0_N]
connect_bd_net [get_bd_pins csi_gearbox_dma_0/csi_lpclk_p] [get_bd_ports CSI_LPCLK_P]
connect_bd_net [get_bd_pins adc_axi_streamer/dbg_acq_run] [get_bd_pins PL_debug_LED_control_0/acq_run] [get_bd_pins PL_debug_LED_control_1/acq_run]
connect_bd_net [get_bd_pins FabCfg_NextGen_0/R_led_ctrl] \
  [get_bd_pins PL_debug_LED_control_0/R_led_ctrl] [get_bd_pins PL_debug_LED_control_1/R_led_ctrl]
connect_bd_net [get_bd_pins PL_debug_LED_control_0/led_out] [get_bd_ports LED_CH0]
connect_bd_net [get_bd_pins PL_debug_LED_control_1/led_out] [get_bd_ports LED_CH1]
connect_bd_net [get_bd_pins FabCfg_NextGen_0/R_csi_ctrl_a] [get_bd_pins csi_gearbox_dma_0/R_csi_ctrl_a]
connect_bd_net [get_bd_pins FabCfg_NextGen_0/R_csi_ctrl_b] [get_bd_pins csi_gearbox_dma_0/R_csi_ctrl_b]
connect_bd_net [get_bd_pins csi_gearbox_dma_0/R_csi_status_a] [get_bd_pins FabCfg_NextGen_0/R_csi_status_a]
connect_bd_net [get_bd_pins adc_axi_streamer/dbg_acq_axi_upcounter] [get_bd_pins system_ila_0/probe0]
connect_bd_net [get_bd_pins adc_axi_streamer/dbg_acq_axi_running] [get_bd_pins system_ila_0/probe1]
connect_bd_net [get_bd_pins adc_axi_streamer/dbg_acq_post_trigger] [get_bd_pins system_ila_0/probe2]
connect_bd_net [get_bd_pins adc_axi_streamer/dbg_trig_post_fifo] [get_bd_pins system_ila_0/probe3]
connect_bd_net [get_bd_pins adc_axi_streamer/dbg_axi_rdy] [get_bd_pins system_ila_0/probe4]
connect_bd_net [get_bd_pins adc_axi_streamer/dbg_adcstream_state] [get_bd_pins system_ila_0/probe8]
connect_bd_net [get_bd_pins adc_trigger_0/dbg_trig_ch_code_state] [get_bd_pins system_ila_0/probe11]
connect_bd_net [get_bd_pins adc_trigger_0/dbg_trig_edge_out] [get_bd_pins system_ila_0/probe12]
connect_bd_net [get_bd_pins adc_trigger_0/dbg_edge_trig_logic] [get_bd_pins system_ila_0/probe13]
connect_bd_net [get_bd_pins adc_axi_streamer/dbg_trig_pos_post_fifo] [get_bd_pins system_ila_0/probe16]
connect_bd_net [get_bd_pins adc_axi_streamer/dbg_wr_data_count] [get_bd_pins system_ila_0/probe17]
set_property HDL_ATTRIBUTE.BMM_INFO_PROCESSOR {arm > design_1 axi_bram_ctrl_0} [get_bd_cells zynq_ps]
set_property HDL_ATTRIBUTE.KEEP_HIERARCHY yes [get_bd_cells zynq_ps]

# ---- address map ----
assign_bd_address -offset 0x00000000 -range 256M -target_address_space [get_bd_addr_spaces adc_dma/Data_S2MM] [get_bd_addr_segs zynq_ps/S_AXI_HP0/HP0_DDR_LOWOCM]
assign_bd_address -offset 0x00000000 -range 256M -target_address_space [get_bd_addr_spaces mipi_dma/Data_MM2S] [get_bd_addr_segs zynq_ps/S_AXI_HP2/HP2_DDR_LOWOCM]
assign_bd_address -offset 0x00000000 -range 256M -target_address_space [get_bd_addr_spaces mipi_dma/Data_SG] [get_bd_addr_segs zynq_ps/S_AXI_HP2/HP2_DDR_LOWOCM]
exclude_bd_addr_seg -offset 0x41E10000 -range 64K -target_address_space [get_bd_addr_spaces mipi_dma/Data_SG] [get_bd_addr_segs adc_dma/S_AXI_LITE/Reg]
exclude_bd_addr_seg -offset 0x44A00000 -range 64K -target_address_space [get_bd_addr_spaces mipi_dma/Data_SG] [get_bd_addr_segs FabCfg_NextGen_0/S00_AXI/S00_AXI_reg]
exclude_bd_addr_seg -offset 0x44A10000 -range 64K -target_address_space [get_bd_addr_spaces mipi_dma/Data_SG] [get_bd_addr_segs clk_wiz_0/s_axi_lite/Reg]
assign_bd_address -offset 0x40400000 -range 64K -target_address_space [get_bd_addr_spaces zynq_ps/Data] [get_bd_addr_segs adc_dma/S_AXI_LITE/Reg]
assign_bd_address -offset 0x40410000 -range 64K -target_address_space [get_bd_addr_spaces zynq_ps/Data] [get_bd_addr_segs mipi_dma/S_AXI_LITE/Reg]
assign_bd_address -offset 0x43C00000 -range 64K -target_address_space [get_bd_addr_spaces zynq_ps/Data] [get_bd_addr_segs FabCfg_NextGen_0/S00_AXI/S00_AXI_reg]
assign_bd_address -offset 0x43C10000 -range 64K -target_address_space [get_bd_addr_spaces zynq_ps/Data] [get_bd_addr_segs clk_wiz_0/s_axi_lite/Reg]

set_property USER_COMMENTS.comment_0 {Clock source for IDELAYE2 blocks} [get_bd_cells /clk_wiz_1]

validate_bd_design
save_bd_design
